# EAGLE design MAX3232 (EAGLE 9.4.2)
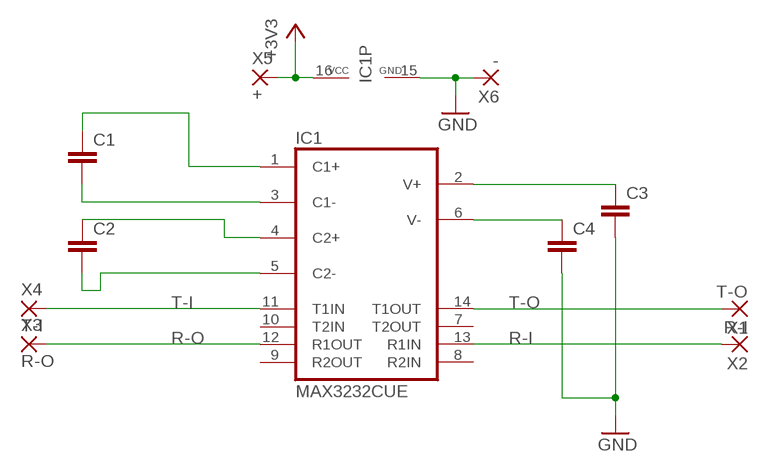
[diagram p0: schematic, sheet 1]

## Parts
C1  CAP_0805  [CAP0805]
C2  CAP_0805  [CAP0805]
C3  CAP_0805  [CAP0805]
C4  CAP_0805  [CAP0805]
IC1  MAX3232CUE  [TSSOP16]
X1  T-O  WIREPAD-SMD2  [PAD-1.27X2.54]
X2  R-I  WIREPAD-SMD2  [PAD-1.27X2.54]
X3  R-O  WIREPAD-SMD2  [PAD-1.27X2.54]
X4  T-I  WIREPAD-SMD2  [PAD-1.27X2.54]
X5  +  WIREPAD-SMD2  [PAD-1.27X2.54]
X6  -  WIREPAD-SMD2  [PAD-1.27X2.54]

## Nets
+3V3: IC1.16(VCC) X5.P$1(P)
GND: C3.2 C4.2 IC1.15(GND) X6.P$1(P)
N$1: C1.1 IC1.1(C1+)
N$2: C1.2 IC1.3(C1-)
N$3: C2.1 IC1.4(C2+)
N$4: C2.2 IC1.5(C2-)
N$5: C4.1 IC1.6(V-)
N$6: C3.1 IC1.2(V+)
R-I: IC1.13(R1IN) X2.P$1(P)
R-O: IC1.12(R1OUT) X3.P$1(P)
T-I: IC1.11(T1IN) X4.P$1(P)
T-O: IC1.14(T1OUT) X1.P$1(P)
Unconnected: IC1.7(T2OUT) IC1.8(R2IN) IC1.9(R2OUT) IC1.10(T2IN)

## Library data of the parts
C1-C4 = Flamberm:CAP_
IC1 = maxim:MAX3232*: True RS-232 Transceivers 3.0V to 5.5V, Low-Power up to 1Mbps, Using Four 0.1µF External Capacitors Source: http://pdfserv.maxim-ic.com/en/ds/MAX3222-MAX3241.pdf; MF: MAXIM; MPN: MAX3232CUE+; OC_FARNELL: 1593350; OC_NEWARK: 68K4629
X1-X6 = Flamberm:WIREPAD-SMD2: SMD PAD

## Board
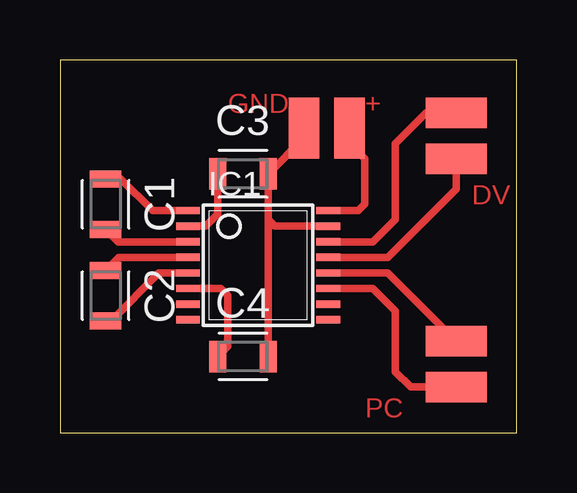
[diagram p1: board, top side]

Size 19.03 x 15.54 mm. Coordinates in mm from the lower left corner, seen from the top.
Outline: 0,0 19.03,0 19.03,15.54 0,15.54 0,0
Copper layers (1*16): Top 0.035mm / dielectric 1.5mm / Bottom 0.035mm
Design rules "default": minimum track width 6mil, minimum drill 0.35mm, track to track 6mil, track to pad 6mil, pad to pad 6mil, via to via 6mil, smd to smd 6mil, copper to edge 40mil, drill to drill 6mil, minimum pad ring 10mil, minimum via ring 8mil, stop-mask expansion 4mil, vias tented up to drill 0mil, thermal gap 10mil

### Footprints (pad centres in the part's own frame; a part is rotated, then mirrored left to right if it is on the bottom)
CAP0805 = smd 0.712 x 1.312: 1 -1.05,0; 2 1.05,0
TSSOP16 = smd 0.305 x 0.991: 1 -2.275,-2.918; 2 -1.625,-2.918; 3 -0.975,-2.918; 4 -0.325,-2.918; 5 0.325,-2.918; 6 0.975,-2.918; 7 1.625,-2.918; 8 2.275,-2.918; 9 2.275,2.918; 10 1.625,2.918; 11 0.975,2.918; 12 0.325,2.918; 13 -0.325,2.918; 14 -0.975,2.918; 15 -1.625,2.918; 16 -2.275,2.918
PAD-1.27X2.54 = smd 2.54 x 1.27: P$1 0,0

### Placement (x,y rotation side)
C1  1.91,9.53 270 top
C2  1.91,5.71 270 top
C3  7.62,10.79 0 top
C4  7.62,3.17 0 top
IC1  8.26,6.99 270 top
X1  16.51,13.34 0 top
X2  16.51,11.43 0 top
X3  16.51,3.81 0 top
X4  16.51,1.91 0 top
X5  12.06,12.7 270 top
X6  10.16,12.7 90 top

### Tracks (layer width: path | path; a pad name or v marks a point on that pad's centre or on a via)
+3V3
  Top 0.305: IC1.16 12.44,9.26 12.7,9.53 12.7,11.43 12.06,12.06 X5.P$1
GND
  Top 0.305: C4.2 8.67,8.89 | 8.67,8.89 C3.2 10.16,12.29 X6.P$1 | IC1.15 8.95,8.61 8.67,8.89
N$1
  Top 0.305: IC1.1 3.85,9.26 2.54,10.57 C1.1
N$2
  Top 0.305: IC1.3 2.42,7.96 C1.2
N$3
  Top 0.305: IC1.4 2.45,7.31 C2.1
N$4
  Top 0.305: IC1.5 4.12,6.66 2.12,4.67 C2.2
N$5
  Top 0.305: IC1.6 6.69,6.01 6.99,5.71 6.99,3.59 C4.1
N$6
  Top 0.305: IC1.2 6.07,8.61 6.57,9.11 C3.1
R-I
  Top 0.305: IC1.13 13.66,7.31 16.51,10.16 X2.P$1
R-O
  Top 0.305: IC1.12 13.66,6.66 X3.P$1
T-I
  Top 0.305: IC1.11 13.04,6.01 13.97,5.08 13.97,2.54 14.61,1.91 X4.P$1
T-O
  Top 0.305: IC1.14 13.04,7.96 13.97,8.89 13.97,12.06 15.24,13.34 X1.P$1

### Text on the board
Top: GND | + | DV | PC